# EAGLE design Speaker_System_Board (EAGLE 8.3.2)
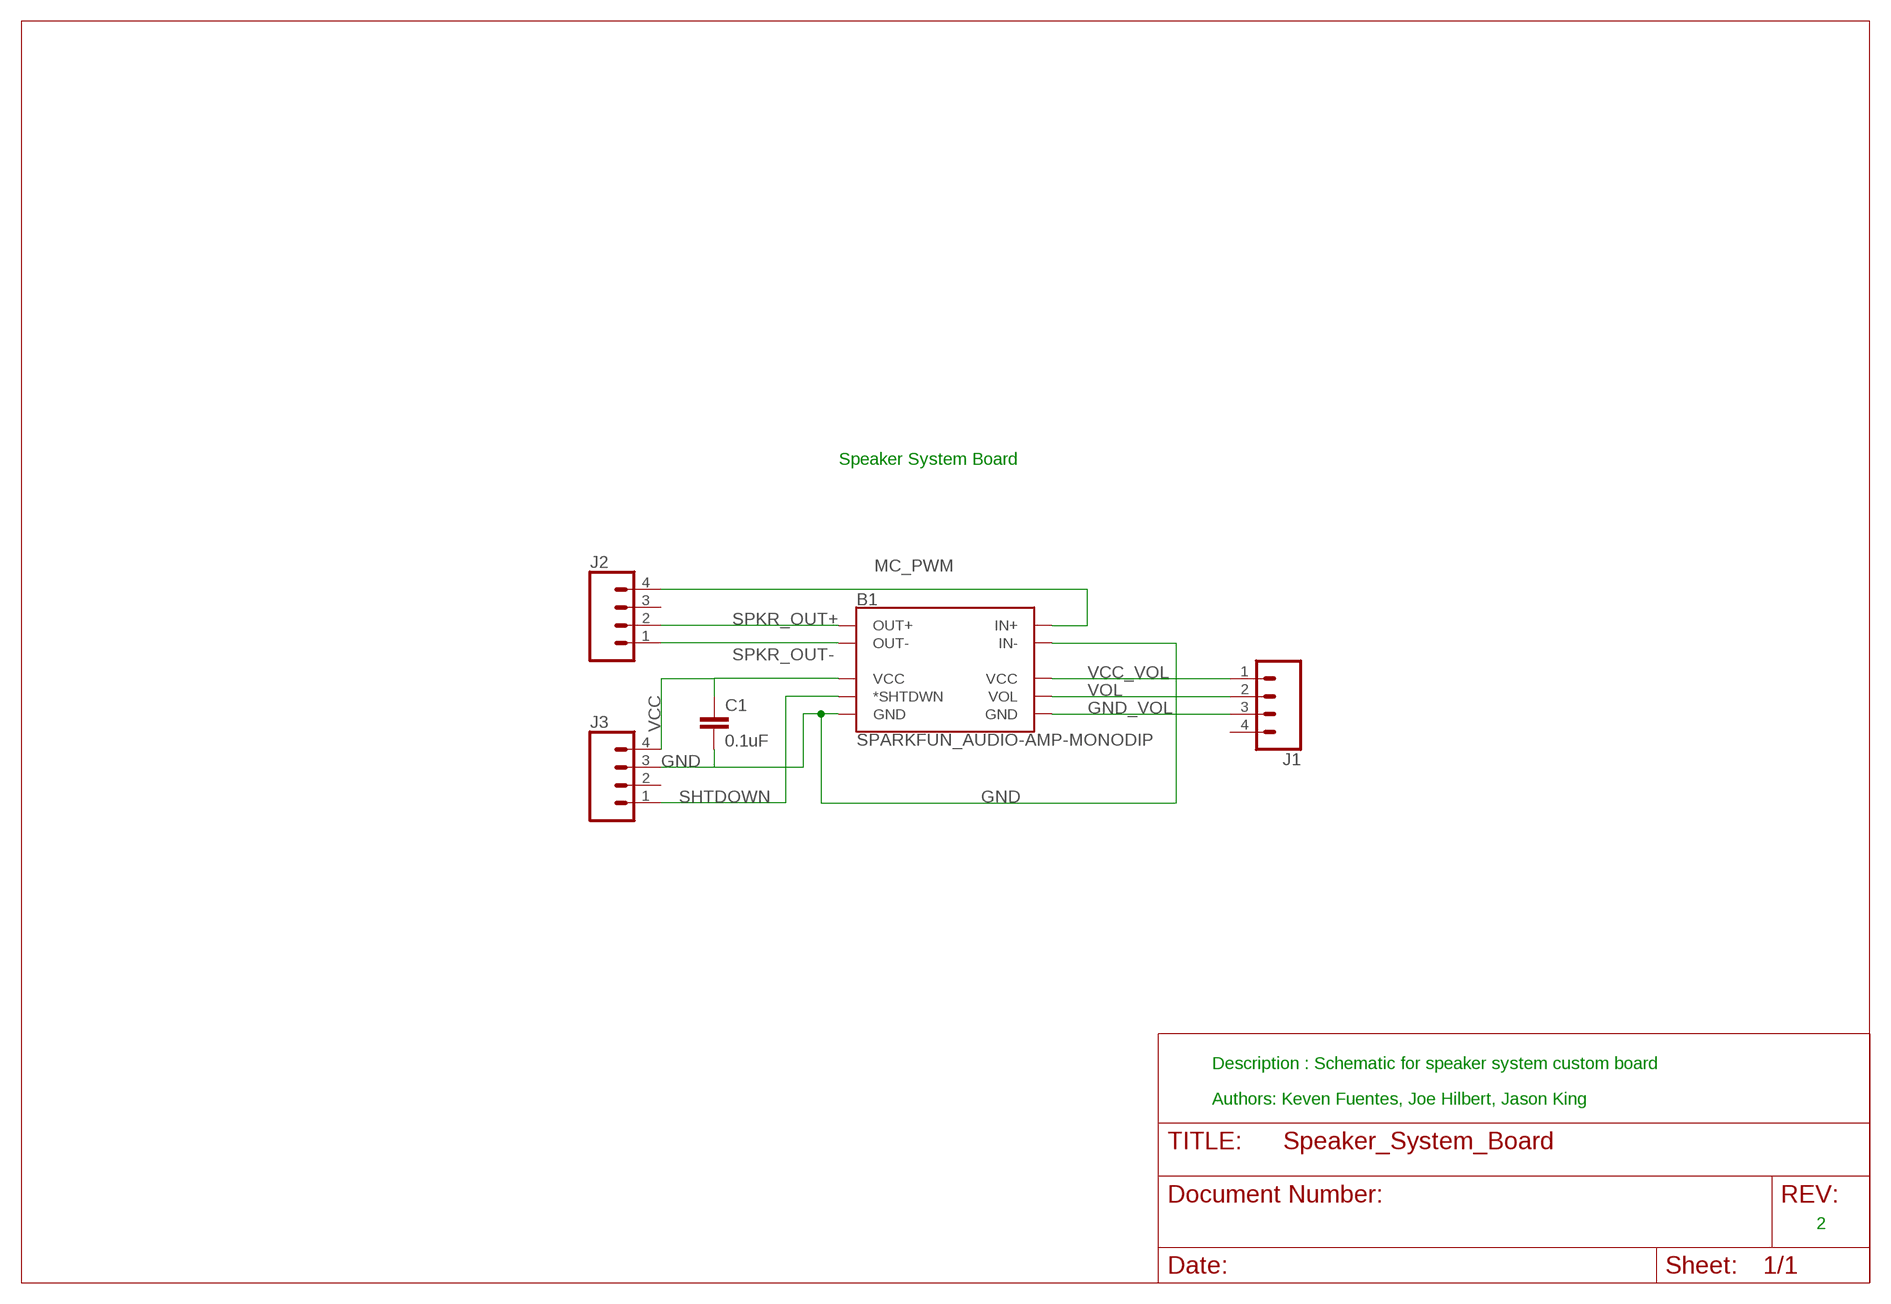
[diagram p0: schematic, sheet 1]

## Parts
B1  SPARKFUN_AUDIO-AMP-MONODIP  [AUDIO-AMP-MONO]
C1  0.1uF  0.1UF-0603-25V-(+80/-20%)  [0603]
J1  CONN_04  [1X04]
J2  CONN_04  [1X04]
J3  CONN_04  [1X04]

## Nets
GND: B1.IN- B1.PWR-(GND) C1.2 J3.3
GND_VOL: B1.VOL-(GND) J1.3
MC_PWM: B1.IN+ J2.4
SHTDOWN: B1.S(*SHTDWN) J3.1
SPKR_OUT+: B1.OUT+ J2.2
SPKR_OUT-: B1.OUT- J2.1
VCC: B1.PWR+(VCC) C1.1 J3.4
VCC_VOL: B1.VOL+(VCC) J1.1
VOL: B1.VOL J1.2
Unconnected: J1.4 J2.3 J3.2

## Notes on the sheet
- Speaker System Board
- Description : Schematic for speaker system custom board
- Authors: Keven Fuentes, Joe Hilbert, Jason King
- 2

## Library data of the parts
B1 = SparkFun-Boards:SPARKFUN_AUDIO-AMP-MONO: SparkFun Mono Audio Amp Breakout- TPA2005D1 This tiny audio amplifier is based on the Texas Instruments TPA2005D1. Its efficient class-D operation means low heat and long battery life. It can drive an 8-Ohm speaker at up to 1.4 Watts SparkFun Products: Mono Audio Amp Breakout <https://www.sparkfun.com/products/11044>
C1 = SparkFun-Capacitors:0.1UF: 0.1µF ceramic capacitors A capacitor is a passive two-terminal electrical component used to store electrical energy temporarily in an electric field.; PROD_ID: CAP-00810
J1-J3 = SparkFun-Connectors:CONN_04: Multi connection point. Often used as Generic Header-pin footprint for 0.1 inch spaced/style header connections On any of the 0.1 inch spaced packages, you can populate with these: Break Away Headers - Straight <https://www.sparkfun.com/products/116> (PRT-00116) Break Away Male Headers - Right Angle <https://www.sparkfun.com/products/553> (PRT-00553) Female Headers <https://www.sparkfun.com/products/115> (PRT-00115) Break Away Headers - Machine Pin <https://www.sparkfun.com/products/117> (PRT-00117) Break Away Female Headers - Swiss Machine Pin <https://www.sparkfun.com/products/743> (PRT-00743) For SCREWTERMINALS and SPRING TERMINALS visit here: Screw Terimnals on SparkFun.com <https://www.sparkfun.com/search/results?term=Screw+Terminals> (5mm/3.5mm/2.54mm spacing) This device is also useful as a general connection point to wire up your design to another part of your project. Our various solder wires solder well into these plated through hole pads. Hook-Up Wire - Assortment (Stranded, 22 AWG) <https://www.sparkfun.com/products/11375> (PRT-11375) Hook-Up Wire - Assortment (Solid Core, 22 AWG) <https://www.sparkfun.com/products/11367> (PRT-11367) View the entire wire category on our website here <https://www.sparkfun.com/categories/141> Special notes: Molex polarized connector foot print use with SKU : PRT-08231 with associated crimp pins and housings. 1MM SMD Version SKU: PRT-10208; PROD_ID: CONN-09696

## Board
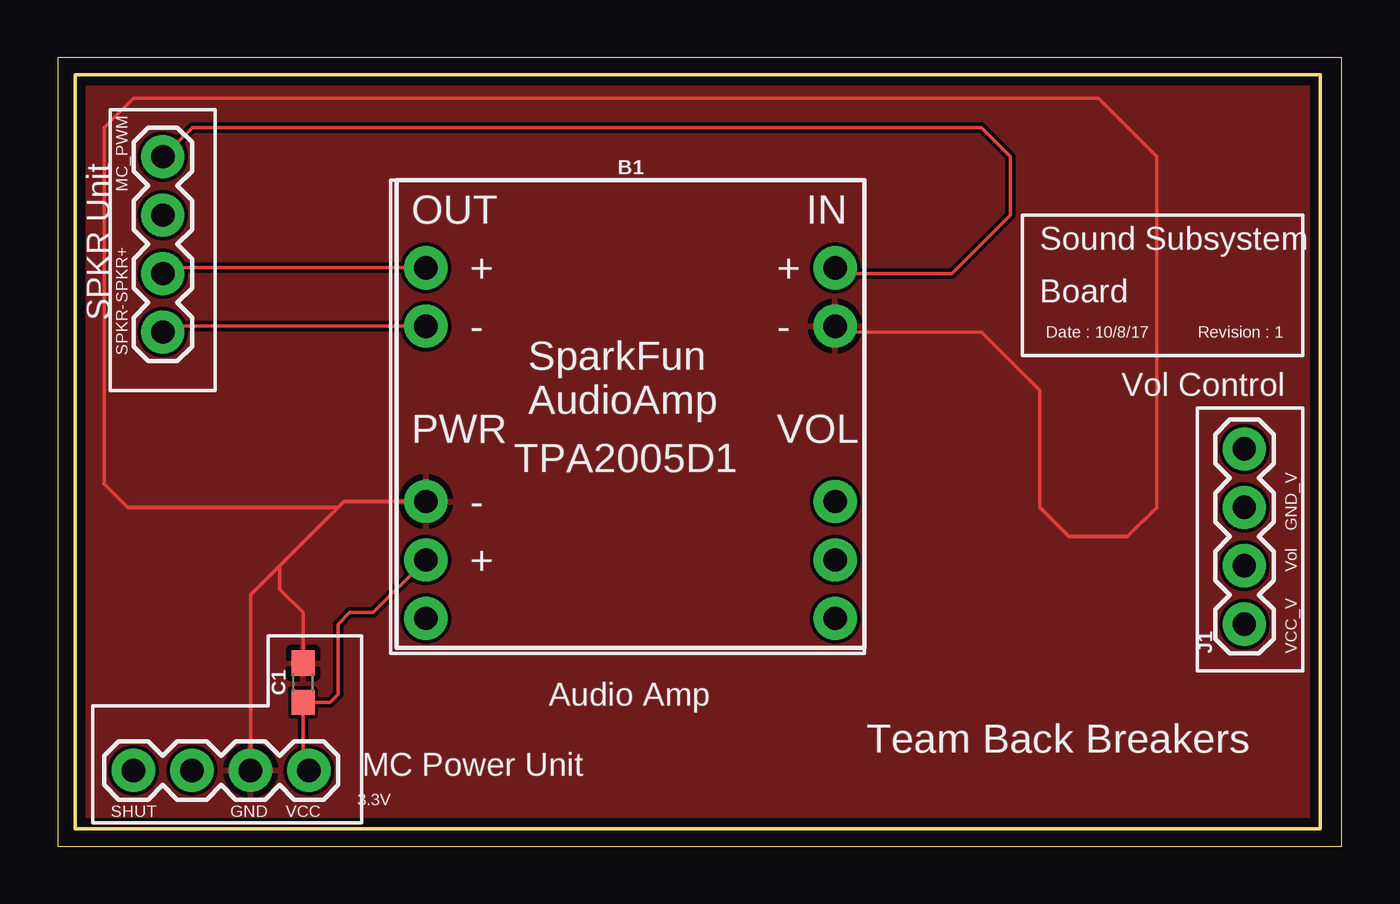
[diagram p1: board, top side]
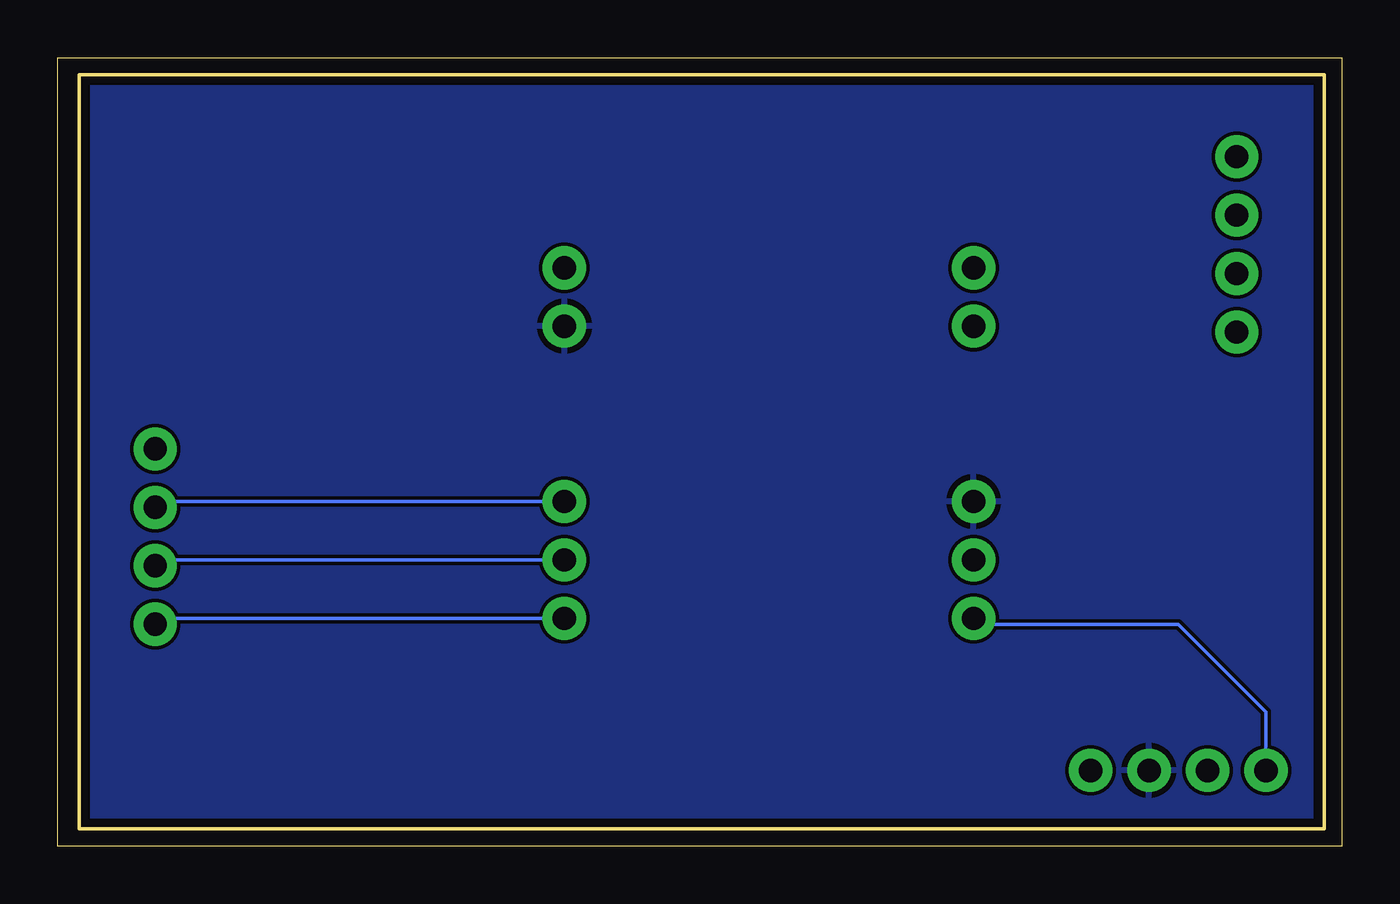
[diagram p2: board, bottom side, seen from below]

Size 55.8 x 34.28 mm. Coordinates in mm from the lower left corner, seen from the top.
Outline: 0,0 55.8,0 55.8,34.28 0,34.28 0,0
Outline: 0.76,33.53 54.86,33.53 54.86,0.76 0.76,0.76 0.76,33.53
Copper layers (1*16): Top 0.0356mm / dielectric 1.5011mm / Bottom 0.0356mm
Design rules "oshpark-2layer": minimum track width 6mil, minimum drill 13mil, track to track 6mil, track to pad 6mil, pad to pad 6mil, via to via 6mil, smd to smd 6mil, copper to edge 15mil, drill to drill 6mil, minimum pad ring 7mil, minimum via ring 7mil, stop-mask expansion 2.5mil, vias tented up to drill 0mil, thermal gap 10mil

### Footprints (pad centres in the part's own frame; a part is rotated, then mirrored left to right if it is on the bottom)
AUDIO-AMP-MONO = drill 1.016 pad 1.88: IN+ 8.89,6.35; IN- 8.89,3.81; OUT+ -8.89,6.35; OUT- -8.89,3.81; PWR+ -8.89,-6.35; PWR- -8.89,-3.81; S -8.89,-8.89; VOL 8.89,-6.35; VOL+ 8.89,-8.89; VOL- 8.89,-3.81
0603 = smd 1.1 x 1: 1 -0.85,0; 2 0.85,0
1X04 = drill 1.016 pad 1.88: 1 0,0; 2 2.54,0; 3 5.08,0; 4 7.62,0

### Placement (x,y rotation side)
B1  24.89,18.8 0 top
C1  10.67,7.11 90 top
J1  51.56,9.65 90 top
J2  4.57,22.35 90 top
J3  3.3,3.3 0 top

### Tracks (layer width: path | path; a pad name or v marks a point on that pad's centre or on a via)
GND
  Top 0.152: 12.19,14.73 9.65,12.19 | 9.65,12.19 8.38,10.92 J3.3 | 12.19,14.73 3.05,14.73 2.03,15.75 2.03,31.24 3.3,32.51 45.21,32.51 47.75,29.97 47.75,14.73 46.48,13.46 43.94,13.46 42.67,14.73 42.67,19.81 40.13,22.35 34.04,22.35 B1.IN- | C1.2 10.67,10.16 9.65,11.18 9.65,12.19 | B1.PWR- 12.45,14.99 12.19,14.73
  pour Top: 0.76,33.53 54.86,33.53 54.86,0.76 0.76,0.76
  pour Bottom: 0.76,33.53 54.86,33.53 54.86,0.76 0.76,0.76
GND_VOL
  Bottom 0.152: B1.VOL- 51.31,14.99 J1.3
MC_PWM
  Top 0.152: J2.4 5.84,31.24 40.13,31.24 41.4,29.97 41.4,27.43 38.86,24.89 34.04,24.89 B1.IN+
SHTDOWN
  Bottom 0.152: J3.1 3.3,5.84 7.11,9.65 15.75,9.65 B1.S
SPKR_OUT+
  Top 0.152: B1.OUT+ 4.83,25.15 J2.2
SPKR_OUT-
  Top 0.152: B1.OUT- 4.83,22.61 J2.1
VCC
  Top 0.152: J3.4 10.67,3.56 C1.1 11.85,6.26 12.19,6.6 12.19,9.65 12.7,10.16 13.72,10.16 B1.PWR+
VCC_VOL
  Bottom 0.152: B1.VOL+ 51.31,9.91 J1.1
VOL
  Bottom 0.152: B1.VOL 51.31,12.45 J1.2

### Text on the board
tPlace: Sound Subsystem | SPKR+ | Board | SPKR Unit | Date : 10/8/17 | Revision : 1 | SPKR- | Vol Control | GND_V | Vol | VCC_V | Audio Amp | Team Back Breakers | MC Power Unit | 3.3V | SHUT | GND | VCC
tNames: MC_PWM